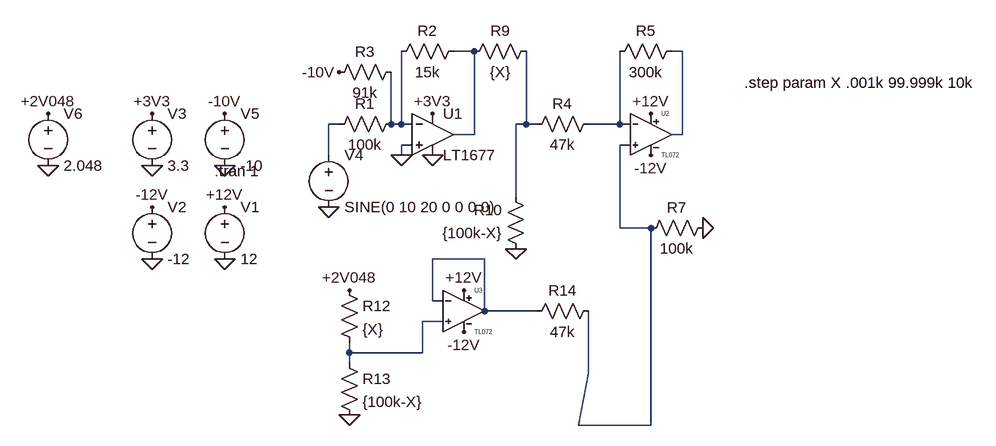
[diagram p0: schematic digital_tests.asc]
digital_tests.asc, the LTspice schematic file:
Version 4
SHEET 1 1208 680
WIRE 304 32 272 32
WIRE 624 32 608 32
WIRE 96 144 80 144
WIRE 176 144 176 64
WIRE 192 144 192 32
WIRE 192 144 176 144
WIRE 208 144 192 144
WIRE 384 144 384 32
WIRE 384 144 368 144
WIRE 400 144 384 144
WIRE 528 144 528 32
WIRE 528 144 480 144
WIRE 544 144 528 144
WIRE 304 160 304 32
WIRE 304 160 272 160
WIRE 624 160 624 32
WIRE 624 160 608 160
WIRE 208 176 192 176
WIRE 544 176 528 176
WIRE 80 192 80 144
WIRE 192 192 192 176
WIRE 368 256 368 144
WIRE 528 304 528 176
WIRE 576 304 528 304
WIRE 320 352 240 352
WIRE 240 416 240 352
WIRE 256 416 240 416
WIRE 320 432 320 352
WIRE 400 432 320 432
WIRE 256 448 224 448
WIRE 112 496 112 480
WIRE 224 496 224 448
WIRE 224 496 112 496
WIRE 112 512 112 496
WIRE 480 528 480 432
WIRE 464 608 480 528
WIRE 576 608 576 304
WIRE 576 608 464 608
FLAG -192 208 0
FLAG -192 352 0
FLAG -80 352 0
FLAG -192 128 +3V3
FLAG 240 128 +3V3
FLAG -192 272 -12V
FLAG -80 272 +12V
FLAG 240 192 0
FLAG 80 272 0
FLAG -80 208 0
FLAG -80 128 -10V
FLAG 96 64 -10V
FLAG 192 192 0
FLAG 576 192 -12V
FLAG 576 128 +12V
FLAG 368 336 0
FLAG 112 592 0
FLAG -352 128 +2V048
FLAG -352 208 0
FLAG 112 400 +2V048
FLAG 656 304 0
FLAG 288 464 -12V
FLAG 288 400 +12V
SYMBOL voltage -80 256 R0
WINDOW 123 0 0 Left 0
WINDOW 39 0 0 Left 0
SYMATTR InstName V1
SYMATTR Value 12
SYMBOL voltage -192 256 R0
WINDOW 123 0 0 Left 0
WINDOW 39 0 0 Left 0
SYMATTR InstName V2
SYMATTR Value -12
SYMBOL voltage -192 112 R0
WINDOW 123 0 0 Left 0
WINDOW 39 0 0 Left 0
SYMATTR InstName V3
SYMATTR Value 3.3
SYMBOL voltage 80 176 R0
WINDOW 123 0 0 Left 0
WINDOW 39 0 0 Left 0
SYMATTR InstName V4
SYMATTR Value SINE(0 10 20 0 0 0 0)
SYMBOL res 192 128 R90
WINDOW 0 0 56 VBottom 2
WINDOW 3 32 56 VTop 2
SYMATTR InstName R1
SYMATTR Value 100k
SYMBOL res 288 16 R90
WINDOW 0 0 56 VBottom 2
WINDOW 3 32 56 VTop 2
SYMATTR InstName R2
SYMATTR Value 15k
SYMBOL res 192 48 R90
WINDOW 0 0 56 VBottom 2
WINDOW 3 32 56 VTop 2
SYMATTR InstName R3
SYMATTR Value 91k
SYMBOL voltage -80 112 R0
WINDOW 123 0 0 Left 0
WINDOW 39 0 0 Left 0
SYMATTR InstName V5
SYMATTR Value -10
SYMBOL Opamps\\LT1677 240 96 R0
SYMATTR InstName U1
SYMBOL TL072 576 96 R0
SYMATTR InstName U2
SYMBOL res 496 128 R90
WINDOW 0 0 56 VBottom 2
WINDOW 3 32 56 VTop 2
SYMATTR InstName R4
SYMATTR Value 47k
SYMBOL res 624 16 R90
WINDOW 0 0 56 VBottom 2
WINDOW 3 32 56 VTop 2
SYMATTR InstName R5
SYMATTR Value 300k
SYMBOL res 400 16 R90
WINDOW 0 0 56 VBottom 2
WINDOW 3 32 56 VTop 2
SYMATTR InstName R9
SYMATTR Value {X}
SYMBOL res 384 352 R180
WINDOW 0 36 76 Left 2
WINDOW 3 36 40 Left 2
SYMATTR InstName R10
SYMATTR Value {100k-X}
SYMBOL res 96 384 R0
SYMATTR InstName R12
SYMATTR Value {X}
SYMBOL res 96 496 R0
SYMATTR InstName R13
SYMATTR Value {100k-X}
SYMBOL voltage -352 112 R0
WINDOW 123 0 0 Left 0
WINDOW 39 0 0 Left 0
SYMATTR InstName V6
SYMATTR Value 2.048
SYMBOL res 496 416 R90
WINDOW 0 0 56 VBottom 2
WINDOW 3 32 56 VTop 2
SYMATTR InstName R14
SYMATTR Value 47k
SYMBOL res 672 288 R90
WINDOW 0 0 56 VBottom 2
WINDOW 3 32 56 VTop 2
SYMATTR InstName R7
SYMATTR Value 100k
SYMBOL TL072 288 368 R0
SYMATTR InstName U3
TEXT -96 216 Left 2 !.tran 1
TEXT 720 80 Left 2 !.step param X .001k 99.999k 10k

The netlist it stands for:
* digital_tests.asc
V1 +12V 0 12
V2 -12V 0 -12
V3 +3V3 0 3.3
V4 N003 0 SINE(0 10 20 0 0 0 0)
R1 N004 N003 100k
R2 N001 N004 15k
R3 N004 -10V 91k
V5 -10V 0 -10
XU1 0 N004 +3V3 0 N001 LT1677  ; pins In+ In- V+ V- OUT
XU2 N007 N006 +12V -12V N002 TL072  ; pins In+ In- V+ V- OUT
R4 N006 N005 47k
R5 N002 N006 300k
R9 N005 N001 {X}
R10 0 N005 {100k-X}
R12 +2V048 N009 {X}
R13 N009 0 {100k-X}
V6 +2V048 0 2.048
R14 N007 N008 47k
R7 0 N007 100k
XU3 N009 N008 +12V -12V N008 TL072  ; pins In+ In- V+ V- OUT
.tran 1
.step param X .001k 99.999k 10k
.lib LTC.lib
.lib TL072.sub
.backanno
.end